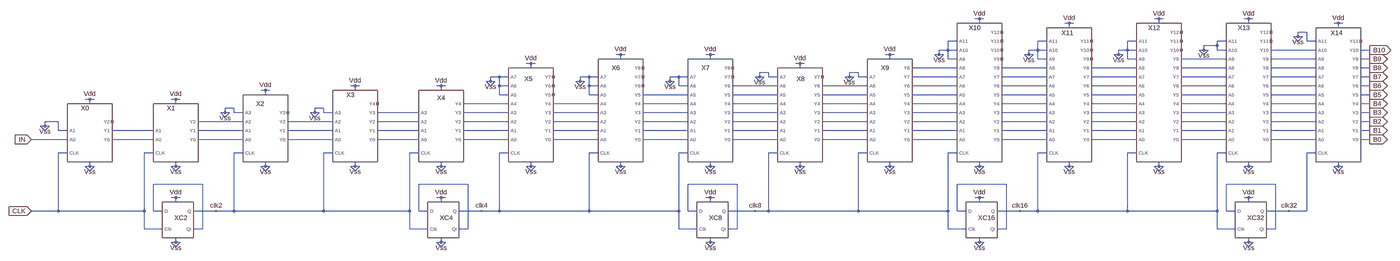
[diagram p0: schematic 5bit_sinc_filter_2nd_order.asc, whole sheet]
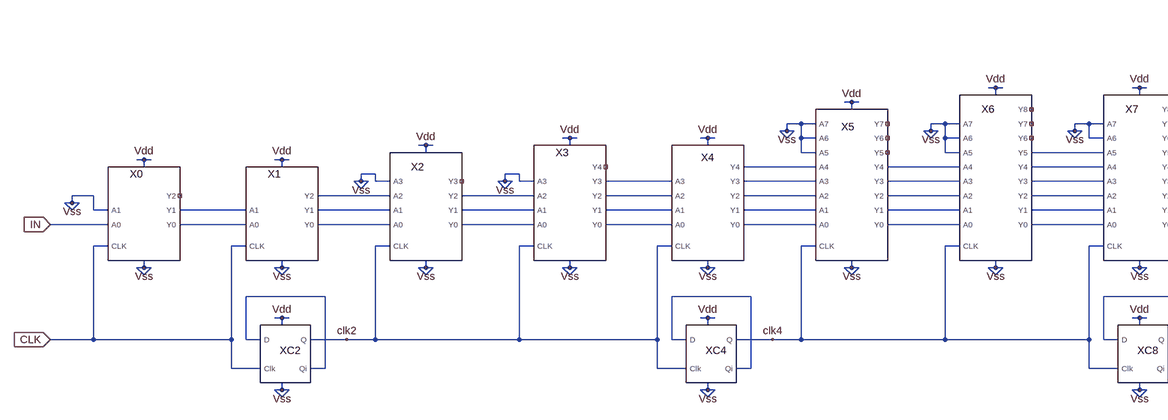
[diagram p1: schematic 5bit_sinc_filter_2nd_order.asc, part, row 1 of 1, column 1 of 2]
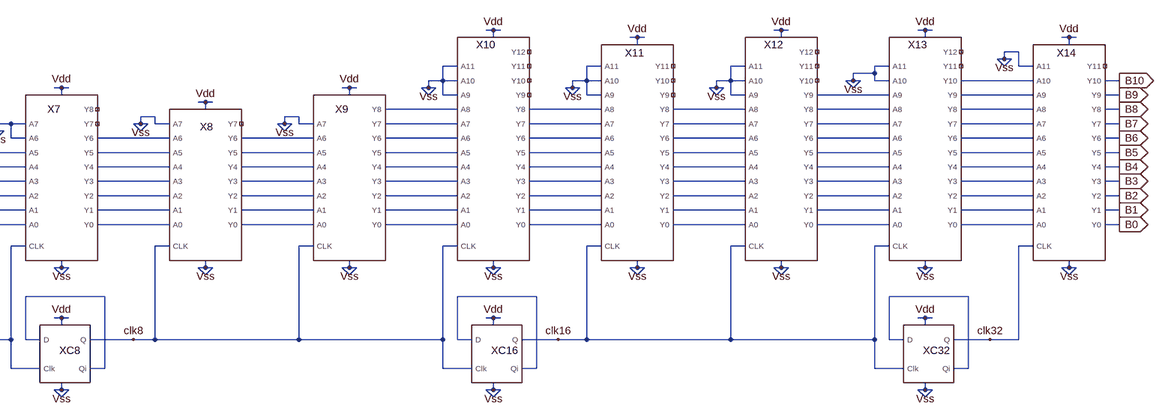
[diagram p2: schematic 5bit_sinc_filter_2nd_order.asc, part, row 1 of 1, column 2 of 2]
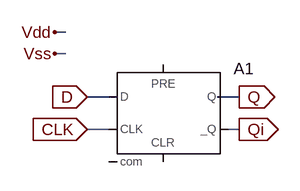
[diagram p3: sub-circuit dff.asc]
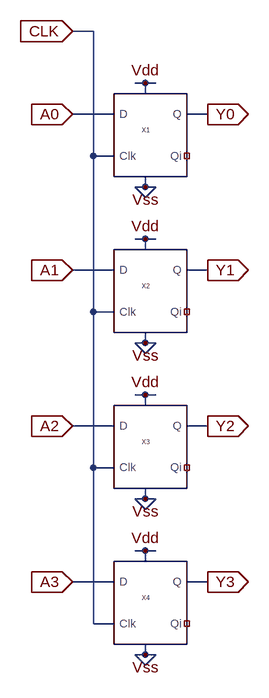
[diagram p4: sub-circuit 4bitreg.asc]
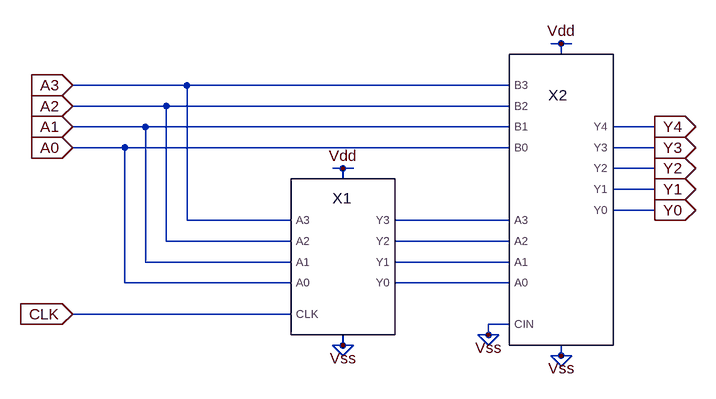
[diagram p5: sub-circuit 4bitavg.asc]
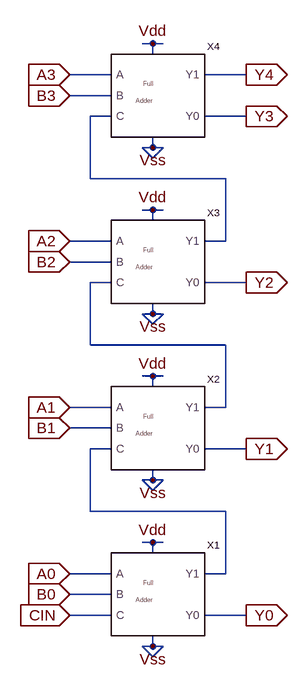
[diagram p6: sub-circuit 4bitadder.asc]
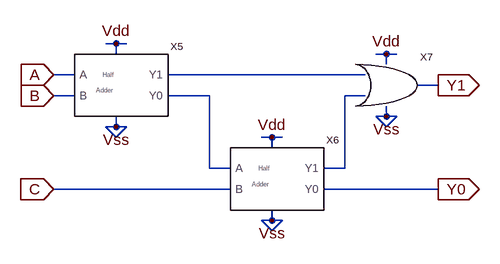
[diagram p7: sub-circuit fulladder.asc]
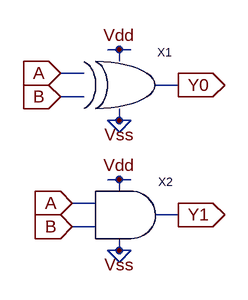
[diagram p8: sub-circuit halfadder.asc]
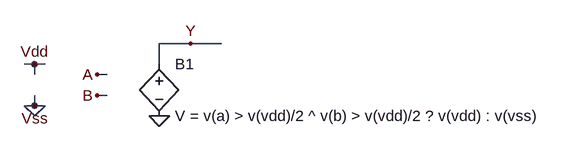
[diagram p9: sub-circuit xor.asc]
5bit_sinc_filter_2nd_order.asc, the LTspice schematic file:
Version 4
SHEET 1 4532 1092
WIRE 2864 -80 2848 -80
WIRE 2880 -80 2864 -80
WIRE 3504 -80 3488 -80
WIRE 3520 -80 3504 -80
WIRE 3824 -80 3808 -80
WIRE 3840 -80 3824 -80
WIRE 2864 -64 2864 -80
WIRE 3184 -64 3168 -64
WIRE 3200 -64 3184 -64
WIRE 3504 -64 3504 -80
WIRE 3824 -64 3824 -80
WIRE 4144 -64 4128 -64
WIRE 4160 -64 4144 -64
WIRE 3184 -48 3184 -64
WIRE 4144 -48 4144 -64
WIRE 4032 -32 4000 -32
WIRE 4000 -16 4000 -32
WIRE 4000 -16 3984 -16
WIRE 4016 -16 4000 -16
WIRE 2784 0 2752 0
WIRE 3104 0 3072 0
WIRE 3424 0 3392 0
WIRE 3744 0 3712 0
WIRE 4000 0 3984 -16
WIRE 4000 0 4016 -16
WIRE 4032 0 4032 -32
WIRE 4064 0 4032 0
WIRE 3712 16 3712 0
WIRE 3712 16 3664 16
WIRE 2752 32 2752 0
WIRE 2752 32 2720 32
WIRE 2784 32 2752 32
WIRE 3072 32 3072 0
WIRE 3072 32 3040 32
WIRE 3104 32 3072 32
WIRE 3392 32 3392 0
WIRE 3392 32 3360 32
WIRE 3424 32 3392 32
WIRE 3664 32 3664 16
WIRE 3664 32 3648 32
WIRE 3680 32 3664 32
WIRE 3712 32 3712 16
WIRE 3744 32 3712 32
WIRE 4064 32 3904 32
WIRE 4256 32 4224 32
WIRE 1584 48 1568 48
WIRE 1600 48 1584 48
WIRE 1904 48 1888 48
WIRE 1920 48 1904 48
WIRE 2544 48 2528 48
WIRE 2560 48 2544 48
WIRE 2720 48 2720 32
WIRE 2720 48 2704 48
WIRE 2736 48 2720 48
WIRE 3040 48 3040 32
WIRE 3040 48 3024 48
WIRE 3056 48 3040 48
WIRE 3360 48 3360 32
WIRE 3360 48 3344 48
WIRE 3376 48 3360 48
WIRE 3664 48 3648 32
WIRE 3664 48 3680 32
WIRE 1584 64 1584 48
WIRE 1904 64 1904 48
WIRE 2544 64 2544 48
WIRE 2720 64 2704 48
WIRE 2720 64 2736 48
WIRE 2752 64 2752 32
WIRE 2784 64 2752 64
WIRE 3040 64 3024 48
WIRE 3040 64 3056 48
WIRE 3072 64 3072 32
WIRE 3104 64 3072 64
WIRE 3360 64 3344 48
WIRE 3360 64 3376 48
WIRE 3392 64 3392 32
WIRE 3424 64 3392 64
WIRE 3744 64 3584 64
WIRE 4064 64 3904 64
WIRE 4256 64 4224 64
WIRE 1264 80 1248 80
WIRE 1280 80 1264 80
WIRE 2224 80 2208 80
WIRE 2240 80 2224 80
WIRE 1264 96 1264 80
WIRE 2224 96 2224 80
WIRE 2784 96 2624 96
WIRE 3104 96 2944 96
WIRE 3424 96 3264 96
WIRE 3744 96 3584 96
WIRE 4064 96 3904 96
WIRE 4256 96 4224 96
WIRE 2112 112 2080 112
WIRE 2432 112 2400 112
WIRE 1152 128 1120 128
WIRE 1184 128 1152 128
WIRE 1472 128 1440 128
WIRE 1504 128 1472 128
WIRE 1792 128 1760 128
WIRE 1824 128 1792 128
WIRE 2080 128 2080 112
WIRE 2080 128 2064 128
WIRE 2096 128 2080 128
WIRE 2112 128 2112 112
WIRE 2144 128 2112 128
WIRE 2400 128 2400 112
WIRE 2400 128 2384 128
WIRE 2416 128 2400 128
WIRE 2432 128 2432 112
WIRE 2464 128 2432 128
WIRE 2784 128 2624 128
WIRE 3104 128 2944 128
WIRE 3424 128 3264 128
WIRE 3744 128 3584 128
WIRE 4064 128 3904 128
WIRE 4256 128 4224 128
WIRE 1120 144 1120 128
WIRE 1120 144 1104 144
WIRE 1136 144 1120 144
WIRE 1440 144 1440 128
WIRE 1440 144 1424 144
WIRE 1456 144 1440 144
WIRE 1760 144 1760 128
WIRE 1760 144 1744 144
WIRE 1776 144 1760 144
WIRE 2080 144 2064 128
WIRE 2080 144 2096 128
WIRE 2400 144 2384 128
WIRE 2400 144 2416 128
WIRE 624 160 608 160
WIRE 640 160 624 160
WIRE 944 160 928 160
WIRE 960 160 944 160
WIRE 1120 160 1104 144
WIRE 1120 160 1136 144
WIRE 1152 160 1152 128
WIRE 1184 160 1152 160
WIRE 1440 160 1424 144
WIRE 1440 160 1456 144
WIRE 1472 160 1472 128
WIRE 1504 160 1472 160
WIRE 1760 160 1744 144
WIRE 1760 160 1776 144
WIRE 1792 160 1792 128
WIRE 1824 160 1792 160
WIRE 2144 160 1984 160
WIRE 2464 160 2304 160
WIRE 2784 160 2624 160
WIRE 3104 160 2944 160
WIRE 3424 160 3264 160
WIRE 3744 160 3584 160
WIRE 4064 160 3904 160
WIRE 4256 160 4224 160
WIRE 304 176 288 176
WIRE 320 176 304 176
WIRE 624 176 624 160
WIRE 944 176 944 160
WIRE 304 192 304 176
WIRE 1152 192 1152 160
WIRE 1184 192 1152 192
WIRE 1472 192 1472 160
WIRE 1504 192 1472 192
WIRE 1824 192 1664 192
WIRE 2144 192 1984 192
WIRE 2464 192 2304 192
WIRE 2784 192 2624 192
WIRE 3104 192 2944 192
WIRE 3424 192 3264 192
WIRE 3744 192 3584 192
WIRE 4064 192 3904 192
WIRE 4256 192 4224 192
WIRE -336 208 -352 208
WIRE -320 208 -336 208
WIRE -16 208 -32 208
WIRE 0 208 -16 208
WIRE -336 224 -336 208
WIRE -16 224 -16 208
WIRE 1184 224 1024 224
WIRE 1504 224 1344 224
WIRE 1824 224 1664 224
WIRE 2144 224 1984 224
WIRE 2464 224 2304 224
WIRE 2784 224 2624 224
WIRE 3104 224 2944 224
WIRE 3424 224 3264 224
WIRE 3744 224 3584 224
WIRE 4064 224 3904 224
WIRE 4256 224 4224 224
WIRE 192 240 160 240
WIRE 512 240 480 240
WIRE 160 256 160 240
WIRE 160 256 144 256
WIRE 176 256 160 256
WIRE 192 256 192 240
WIRE 224 256 192 256
WIRE 480 256 480 240
WIRE 480 256 464 256
WIRE 496 256 480 256
WIRE 512 256 512 240
WIRE 544 256 512 256
WIRE 864 256 704 256
WIRE 1184 256 1024 256
WIRE 1504 256 1344 256
WIRE 1824 256 1664 256
WIRE 2144 256 1984 256
WIRE 2464 256 2304 256
WIRE 2784 256 2624 256
WIRE 3104 256 2944 256
WIRE 3424 256 3264 256
WIRE 3744 256 3584 256
WIRE 4064 256 3904 256
WIRE 4256 256 4224 256
WIRE 160 272 144 256
WIRE 160 272 176 256
WIRE 480 272 464 256
WIRE 480 272 496 256
WIRE -448 288 -496 288
WIRE 224 288 64 288
WIRE 544 288 384 288
WIRE 864 288 704 288
WIRE 1184 288 1024 288
WIRE 1504 288 1344 288
WIRE 1824 288 1664 288
WIRE 2144 288 1984 288
WIRE 2464 288 2304 288
WIRE 2784 288 2624 288
WIRE 3104 288 2944 288
WIRE 3424 288 3264 288
WIRE 3744 288 3584 288
WIRE 4064 288 3904 288
WIRE 4256 288 4224 288
WIRE -496 304 -496 288
WIRE -496 304 -512 304
WIRE -480 304 -496 304
WIRE -496 320 -512 304
WIRE -496 320 -480 304
WIRE -448 320 -448 288
WIRE -416 320 -448 320
WIRE -96 320 -256 320
WIRE 224 320 64 320
WIRE 544 320 384 320
WIRE 864 320 704 320
WIRE 1184 320 1024 320
WIRE 1504 320 1344 320
WIRE 1824 320 1664 320
WIRE 2144 320 1984 320
WIRE 2464 320 2304 320
WIRE 2784 320 2624 320
WIRE 3104 320 2944 320
WIRE 3424 320 3264 320
WIRE 3744 320 3584 320
WIRE 4064 320 3904 320
WIRE 4256 320 4224 320
WIRE -416 352 -544 352
WIRE -96 352 -256 352
WIRE 224 352 64 352
WIRE 544 352 384 352
WIRE 864 352 704 352
WIRE 1184 352 1024 352
WIRE 1504 352 1344 352
WIRE 1824 352 1664 352
WIRE 2144 352 1984 352
WIRE 2464 352 2304 352
WIRE 2784 352 2624 352
WIRE 3104 352 2944 352
WIRE 3424 352 3264 352
WIRE 3744 352 3584 352
WIRE 4064 352 3904 352
WIRE 4256 352 4224 352
WIRE -416 400 -448 400
WIRE -96 400 -128 400
WIRE 224 400 192 400
WIRE 544 400 512 400
WIRE 864 400 832 400
WIRE 1184 400 1152 400
WIRE 1504 400 1472 400
WIRE 1824 400 1792 400
WIRE 2144 400 2112 400
WIRE 2464 400 2432 400
WIRE 2784 400 2752 400
WIRE 3104 400 3072 400
WIRE 3424 400 3392 400
WIRE 3744 400 3712 400
WIRE 4064 400 4032 400
WIRE -336 448 -336 432
WIRE -336 448 -352 448
WIRE -320 448 -336 448
WIRE -16 448 -16 432
WIRE -16 448 -32 448
WIRE 0 448 -16 448
WIRE 304 448 304 432
WIRE 304 448 288 448
WIRE 320 448 304 448
WIRE 624 448 624 432
WIRE 624 448 608 448
WIRE 640 448 624 448
WIRE 944 448 944 432
WIRE 944 448 928 448
WIRE 960 448 944 448
WIRE 1264 448 1264 432
WIRE 1264 448 1248 448
WIRE 1280 448 1264 448
WIRE 1584 448 1584 432
WIRE 1584 448 1568 448
WIRE 1600 448 1584 448
WIRE 1904 448 1904 432
WIRE 1904 448 1888 448
WIRE 1920 448 1904 448
WIRE 2224 448 2224 432
WIRE 2224 448 2208 448
WIRE 2240 448 2224 448
WIRE 2544 448 2544 432
WIRE 2544 448 2528 448
WIRE 2560 448 2544 448
WIRE 2864 448 2864 432
WIRE 2864 448 2848 448
WIRE 2880 448 2864 448
WIRE 3184 448 3184 432
WIRE 3184 448 3168 448
WIRE 3200 448 3184 448
WIRE 3504 448 3504 432
WIRE 3504 448 3488 448
WIRE 3520 448 3504 448
WIRE 3824 448 3824 432
WIRE 3824 448 3808 448
WIRE 3840 448 3824 448
WIRE 4144 448 4144 432
WIRE 4144 448 4128 448
WIRE 4160 448 4144 448
WIRE -336 464 -352 448
WIRE -336 464 -320 448
WIRE -16 464 -32 448
WIRE -16 464 0 448
WIRE 304 464 288 448
WIRE 304 464 320 448
WIRE 624 464 608 448
WIRE 624 464 640 448
WIRE 944 464 928 448
WIRE 944 464 960 448
WIRE 1264 464 1248 448
WIRE 1264 464 1280 448
WIRE 1584 464 1568 448
WIRE 1584 464 1600 448
WIRE 1904 464 1888 448
WIRE 1904 464 1920 448
WIRE 2224 464 2208 448
WIRE 2224 464 2240 448
WIRE 2544 464 2528 448
WIRE 2544 464 2560 448
WIRE 2864 464 2848 448
WIRE 2864 464 2880 448
WIRE 3184 464 3168 448
WIRE 3184 464 3200 448
WIRE 3504 464 3488 448
WIRE 3504 464 3520 448
WIRE 3824 464 3808 448
WIRE 3824 464 3840 448
WIRE 4144 464 4128 448
WIRE 4144 464 4160 448
WIRE 80 512 -96 512
WIRE 1040 512 864 512
WIRE 2000 512 1824 512
WIRE 2960 512 2784 512
WIRE 3920 512 3744 512
WIRE -16 560 -32 560
WIRE 0 560 -16 560
WIRE 944 560 928 560
WIRE 960 560 944 560
WIRE 1904 560 1888 560
WIRE 1920 560 1904 560
WIRE 2864 560 2848 560
WIRE 2880 560 2864 560
WIRE 3824 560 3808 560
WIRE 3840 560 3824 560
WIRE -16 576 -16 560
WIRE 944 576 944 560
WIRE 1904 576 1904 560
WIRE 2864 576 2864 560
WIRE 3824 576 3824 560
WIRE -448 608 -448 400
WIRE -448 608 -544 608
WIRE -128 608 -128 400
WIRE -128 608 -448 608
WIRE -96 608 -96 512
WIRE -64 608 -96 608
WIRE 128 608 48 608
WIRE 192 608 192 400
WIRE 192 608 128 608
WIRE 512 608 512 400
WIRE 512 608 192 608
WIRE 832 608 832 400
WIRE 832 608 512 608
WIRE 864 608 864 512
WIRE 896 608 864 608
WIRE 1088 608 1008 608
WIRE 1152 608 1152 400
WIRE 1152 608 1088 608
WIRE 1472 608 1472 400
WIRE 1472 608 1152 608
WIRE 1792 608 1792 400
WIRE 1792 608 1472 608
WIRE 1824 608 1824 512
WIRE 1856 608 1824 608
WIRE 2064 608 1968 608
WIRE 2112 608 2112 400
WIRE 2112 608 2064 608
WIRE 2432 608 2432 400
WIRE 2432 608 2112 608
WIRE 2752 608 2752 400
WIRE 2752 608 2432 608
WIRE 2784 608 2784 512
WIRE 2816 608 2784 608
WIRE 3008 608 2928 608
WIRE 3072 608 3072 400
WIRE 3072 608 3008 608
WIRE 3392 608 3392 400
WIRE 3392 608 3072 608
WIRE 3712 608 3712 400
WIRE 3712 608 3392 608
WIRE 3744 608 3744 512
WIRE 3776 608 3744 608
WIRE 3968 608 3888 608
WIRE 4032 608 4032 400
WIRE 4032 608 3968 608
WIRE -128 672 -128 608
WIRE -64 672 -128 672
WIRE 80 672 80 512
WIRE 80 672 48 672
WIRE 832 672 832 608
WIRE 896 672 832 672
WIRE 1040 672 1040 512
WIRE 1040 672 1008 672
WIRE 1792 672 1792 608
WIRE 1856 672 1792 672
WIRE 2000 672 2000 512
WIRE 2000 672 1968 672
WIRE 2752 672 2752 608
WIRE 2816 672 2752 672
WIRE 2960 672 2960 512
WIRE 2960 672 2928 672
WIRE 3712 672 3712 608
WIRE 3776 672 3712 672
WIRE 3920 672 3920 512
WIRE 3920 672 3888 672
WIRE -16 720 -16 704
WIRE -16 720 -32 720
WIRE 0 720 -16 720
WIRE 944 720 944 704
WIRE 944 720 928 720
WIRE 960 720 944 720
WIRE 1904 720 1904 704
WIRE 1904 720 1888 720
WIRE 1920 720 1904 720
WIRE 2864 720 2864 704
WIRE 2864 720 2848 720
WIRE 2880 720 2864 720
WIRE 3824 720 3824 704
WIRE 3824 720 3808 720
WIRE 3840 720 3824 720
WIRE -16 736 -32 720
WIRE -16 736 0 720
WIRE 944 736 928 720
WIRE 944 736 960 720
WIRE 1904 736 1888 720
WIRE 1904 736 1920 720
WIRE 2864 736 2848 720
WIRE 2864 736 2880 720
WIRE 3824 736 3808 720
WIRE 3824 736 3840 720
FLAG 304 448 Vss
FLAG 4256 352 B0
IOPIN 4256 352 Out
FLAG 4256 320 B1
IOPIN 4256 320 Out
FLAG 4256 288 B2
IOPIN 4256 288 Out
FLAG 4256 256 B3
IOPIN 4256 256 Out
FLAG 4256 224 B4
IOPIN 4256 224 Out
FLAG 4256 192 B5
IOPIN 4256 192 Out
FLAG 4256 160 B6
IOPIN 4256 160 Out
FLAG 4256 128 B7
IOPIN 4256 128 Out
FLAG -16 560 Vdd
FLAG -16 720 Vss
FLAG -336 448 Vss
FLAG -336 208 Vdd
FLAG -16 448 Vss
FLAG -16 208 Vdd
FLAG -544 608 CLK
IOPIN -544 608 In
FLAG -544 352 IN
IOPIN -544 352 In
FLAG -496 304 Vss
FLAG 160 256 Vss
FLAG 1264 80 Vdd
FLAG 1264 448 Vss
FLAG 944 560 Vdd
FLAG 944 720 Vss
FLAG 624 448 Vss
FLAG 944 448 Vss
FLAG 480 256 Vss
FLAG 1120 144 Vss
FLAG 2224 80 Vdd
FLAG 2224 448 Vss
FLAG 1904 560 Vdd
FLAG 1904 720 Vss
FLAG 1584 448 Vss
FLAG 1584 48 Vdd
FLAG 1904 448 Vss
FLAG 1904 48 Vdd
FLAG 1440 144 Vss
FLAG 1760 144 Vss
FLAG 2080 128 Vss
FLAG 3184 -64 Vdd
FLAG 3184 448 Vss
FLAG 2864 560 Vdd
FLAG 2864 720 Vss
FLAG 2544 448 Vss
FLAG 2544 48 Vdd
FLAG 2864 448 Vss
FLAG 2864 -80 Vdd
FLAG 2400 128 Vss
FLAG 128 608 clk2
FLAG 1088 608 clk4
FLAG 2064 608 clk8
FLAG 3008 608 clk16
FLAG 304 176 Vdd
FLAG 624 160 Vdd
FLAG 944 160 Vdd
FLAG 2720 48 Vss
FLAG 3040 48 Vss
FLAG 4144 -64 Vdd
FLAG 4144 448 Vss
FLAG 3824 560 Vdd
FLAG 3824 720 Vss
FLAG 3504 448 Vss
FLAG 3824 448 Vss
FLAG 3824 -80 Vdd
FLAG 3968 608 clk32
FLAG 3664 32 Vss
FLAG 4000 -16 Vss
FLAG 3504 -80 Vdd
FLAG 3360 48 Vss
FLAG 4256 96 B8
IOPIN 4256 96 Out
FLAG 4256 64 B9
IOPIN 4256 64 Out
FLAG 4256 32 B10
IOPIN 4256 32 Out
SYMBOL dff -64 704 R0
SYMATTR InstName XC2
SYMBOL dff 896 704 R0
SYMATTR InstName XC4
SYMBOL dff 1856 704 R0
SYMATTR InstName XC8
SYMBOL dff 2816 704 R0
SYMATTR InstName XC16
SYMBOL 4bitreg 224 432 R0
SYMATTR InstName X2
SYMBOL 4bitavg 544 432 R0
SYMATTR InstName X3
SYMBOL 4bitavg 864 432 R0
WINDOW 0 65 -229 Left 0
SYMATTR InstName X4
SYMBOL 8bitreg 1184 432 R0
WINDOW 1 76 -102 VLeft 0
WINDOW 0 57 -297 Left 0
SYMATTR InstName X5
SYMBOL 8bitreg 2144 432 R0
WINDOW 1 88 -121 VLeft 0
WINDOW 0 68 -297 Left 0
SYMATTR InstName X8
SYMBOL 8bitavg 1504 432 R0
WINDOW 1 77 -129 VLeft 0
SYMATTR InstName X6
SYMBOL 8bitavg 1824 432 R0
WINDOW 1 88 -103 VLeft 0
SYMATTR InstName X7
SYMBOL 8bitavg 2464 432 R0
WINDOW 1 82 -126 VLeft 0
SYMATTR InstName X9
SYMBOL 2bitavg -416 432 R0
SYMATTR InstName X0
SYMBOL 2bitavg -96 432 R0
SYMATTR InstName X1
SYMBOL 12bitavg 2784 432 R0
WINDOW 1 71 -156 VLeft 0
SYMATTR InstName X10
SYMBOL 12bitreg 3104 432 R0
WINDOW 1 74 -170 VLeft 0
SYMATTR InstName X11
SYMBOL dff 3776 704 R0
SYMATTR InstName XC32
SYMBOL 12bitavg 3744 432 R0
WINDOW 1 80 -199 VLeft 0
SYMATTR InstName X13
SYMBOL 12bitreg 4064 432 R0
WINDOW 1 81 -180 VLeft 0
SYMATTR InstName X14
SYMBOL 12bitavg 3424 432 R0
WINDOW 1 85 -218 VLeft 0
SYMATTR InstName X12

The netlist it stands for:
* 5bit_sinc_filter_2nd_order.asc
XXC2 N091 CLK clk2 N091 Vdd Vss dff
XXC4 N092 clk2 clk4 N092 Vdd Vss dff
XXC8 N093 clk4 clk8 N093 Vdd Vss dff
XXC16 N094 clk8 clk16 N094 Vdd Vss dff
XX2 Vdd Vss clk2 N078 N064 N050 Vss N079 N065 N051 NC_01 4bitreg
XX3 Vdd Vss clk2 N079 N065 N051 Vss N080 N066 N052 N039 NC_02 4bitavg
XX4 Vdd Vss clk2 N080 N066 N052 N039 N081 N067 N053 N040 N029 4bitavg
XX5 Vdd Vss clk4 N081 N067 N053 N040 N029 Vss Vss Vss N082 N068 N054 N041 N030 NC_03 NC_04 NC_05 8bitreg
XX8 Vdd Vss clk8 N084 N070 N056 N043 N032 N022 N014 Vss N085 N071 N057 N044 N033 N023 N015 NC_06 8bitreg
XX6 Vdd Vss clk4 N082 N068 N054 N041 N030 Vss Vss Vss N083 N069 N055 N042 N031 N021 NC_07 NC_08 NC_09 8bitavg
XX7 Vdd Vss clk4 N083 N069 N055 N042 N031 N021 Vss Vss N084 N070 N056 N043 N032 N022 N014 NC_10 NC_11 8bitavg
XX9 Vdd Vss clk8 N085 N071 N057 N044 N033 N023 N015 Vss N086 N072 N058 N045 N034 N024 N016 N009 N004 8bitavg
XX0 Vdd Vss CLK IN Vss N077 N063 NC_12 2bitavg
XX1 Vdd Vss CLK N077 N063 N078 N064 N050 2bitavg
XX10 Vdd Vss clk8 N086 N072 N058 N045 N034 N024 N016 N009 N004 Vss Vss Vss N087 N073 N059 N046 N035 N025 N017 N010 N005 NC_13 NC_14 NC_15 NC_16 12bitavg
XX11 Vdd Vss clk16 N087 N073 N059 N046 N035 N025 N017 N010 N005 Vss Vss Vss N088 N074 N060 N047 N036 N026 N018 N011 N006 NC_17 NC_18 NC_19 12bitreg
XXC32 N095 clk16 clk32 N095 Vdd Vss dff
XX13 Vdd Vss clk16 N089 N075 N061 N048 N037 N027 N019 N012 N007 N002 Vss Vss N090 N076 N062 N049 N038 N028 N020 N013 N008 N003 N001 NC_20 NC_21 12bitavg
XX14 Vdd Vss clk32 N090 N076 N062 N049 N038 N028 N020 N013 N008 N003 N001 Vss B0 B1 B2 B3 B4 B5 B6 B7 B8 B9 B10 NC_22 12bitreg
XX12 Vdd Vss clk16 N088 N074 N060 N047 N036 N026 N018 N011 N006 Vss Vss Vss N089 N075 N061 N048 N037 N027 N019 N012 N007 N002 NC_23 NC_24 NC_25 12bitavg

* block symbol definitions
.subckt dff D Clk Q Qi VDD Vss
A1 D 0 CLK 0 0 Qi Q 0 DFLOP vhigh=5 tau=1n
.ends dff

.subckt 4bitreg Vdd Vss CLK A0 A1 A2 A3 Y0 Y1 Y2 Y3
XX1 A0 CLK Y0 NC_01 Vdd Vss dff
XX2 A1 CLK Y1 NC_02 Vdd Vss dff
XX3 A2 CLK Y2 NC_03 Vdd Vss dff
XX4 A3 CLK Y3 NC_04 Vdd Vss dff
.ends 4bitreg

.subckt 4bitavg Vdd Vss CLK A0 A1 A2 A3 Y0 Y1 Y2 Y3 Y4
XX1 Vdd Vss CLK A0 A1 A2 A3 N004 N003 N002 N001 4bitreg
XX2 Vdd Vss Vss N004 N003 N002 N001 A0 A1 A2 A3 Y0 Y1 Y2 Y3 Y4 4bitadder
.ends 4bitavg

.subckt 4bitadder Vdd Vss CIN A0 A1 A2 A3 B0 B1 B2 B3 Y0 Y1 Y2 Y3 Y4
XX1 A0 B0 Y0 N003 Vdd Vss CIN fulladder
XX2 A1 B1 Y1 N002 Vdd Vss N003 fulladder
XX3 A2 B2 Y2 N001 Vdd Vss N002 fulladder
XX4 A3 B3 Y3 Y4 Vdd Vss N001 fulladder
.ends 4bitadder

.subckt fulladder A B Y0 Y1 Vdd Vss C
XX5 A B N002 N001 Vdd Vss halfadder
XX6 N002 C Y0 N003 Vdd Vss halfadder
XX7 N001 N003 Y1 Vdd Vss or
.ends fulladder

.subckt halfadder A B Y0 Y1 Vdd Vss
XX1 A B Y0 Vdd Vss xor
XX2 A B Y1 Vdd Vss and
.ends halfadder

.subckt xor A B Y Vdd Vss
B1 Y 0 V = v(a) > v(vdd)/2 ^ v(b) > v(vdd)/2 ? v(vdd) : v(vss)
.ends xor

.subckt and A B Y Vdd Vss
B1 Y 0 V=((v(a)>v(vdd)/2)&(v(b)>v(vdd)/2)) ? v(vdd) : v(vss)
.ends and

.subckt or A B Y Vdd Vss
B1 Y 0 V=v(a)>v(vdd)/2 | v(b)>v(vdd)/2 ? v(vdd) : v(vss)
.ends or

.subckt 8bitreg Vdd Vss CLK A0 A1 A2 A3 A4 A5 A6 A7 Y0 Y1 Y2 Y3 Y4 Y5 Y6 Y7
XX1 A0 CLK Y0 NC_01 Vdd Vss dff
XX2 A1 CLK Y1 NC_02 Vdd Vss dff
XX3 A2 CLK Y2 NC_03 Vdd Vss dff
XX4 A3 CLK Y3 NC_04 Vdd Vss dff
XX5 A4 CLK Y4 NC_05 Vdd Vss dff
XX6 A5 CLK Y5 NC_06 Vdd Vss dff
XX7 A6 CLK Y6 NC_07 Vdd Vss dff
XX8 A7 CLK Y7 NC_08 Vdd Vss dff
.ends 8bitreg

.subckt 8bitavg Vdd Vss CLK A0 A1 A2 A3 A4 A5 A6 A7 Y0 Y1 Y2 Y3 Y4 Y5 Y6 Y7 Y8
XX3 Vdd Vss CLK A0 A1 A2 A3 A4 A5 A6 A7 N008 N007 N006 N005 N004 N003 N002 N001 8bitreg
XX4 Vdd Vss Vss N008 N007 N006 N005 N004 N003 N002 N001 A0 A1 A2 A3 A4 A5 A6 A7 Y0 Y1 Y2 Y3 Y4 Y5 Y6 Y7 Y8 8bitadder
.ends 8bitavg

.subckt 8bitadder Vdd Vss CIN A0 A1 A2 A3 A4 A5 A6 A7 B0 B1 B2 B3 B4 B5 B6 B7 Y0 Y1 Y2 Y3 Y4 Y5 Y6 Y7 Y8
XX1 A0 B0 Y0 N006 Vdd Vss CIN fulladder
XX2 A1 B1 Y1 N004 Vdd Vss N006 fulladder
XX3 A2 B2 Y2 N002 Vdd Vss N004 fulladder
XX4 A3 B3 Y3 N001 Vdd Vss N002 fulladder
XX5 A4 B4 Y4 N007 Vdd Vss N001 fulladder
XX6 A5 B5 Y5 N005 Vdd Vss N007 fulladder
XX7 A6 B6 Y6 N003 Vdd Vss N005 fulladder
XX8 A7 B7 Y7 Y8 Vdd Vss N003 fulladder
.ends 8bitadder

.subckt 2bitavg Vdd Vss CLK A0 A1 Y0 Y1 Y2
XX1 Vdd Vss CLK A0 A1 N002 N001 2bitreg
XX2 Vdd Vss Vss N002 N001 A0 A1 Y0 Y1 Y2 2bitadder
.ends 2bitavg

.subckt 2bitreg Vdd Vss CLK A0 A1 Y0 Y1
XX1 A0 CLK Y0 NC_01 Vdd Vss dff
XX2 A1 CLK Y1 NC_02 Vdd Vss dff
.ends 2bitreg

.subckt 2bitadder Vdd Vss CIN A0 A1 B0 B1 Y0 Y1 Y2
XX1 A0 B0 Y0 N001 Vdd Vss CIN fulladder
XX2 A1 B1 Y1 Y2 Vdd Vss N001 fulladder
.ends 2bitadder

.subckt 12bitavg Vdd Vss CLK A0 A1 A2 A3 A4 A5 A6 A7 A8 A9 A10 A11 Y0 Y1 Y2 Y3 Y4 Y5 Y6 Y7 Y8 Y9 Y10 Y11 Y12
XX1 Vdd Vss Vss N012 N011 N010 N009 N008 N007 N006 N005 N004 N003 N002 N001 A0 A1 A2 A3 A4 A5 A6 A7 A8 A9 A10 A11 Y0 Y1 Y2 Y3 Y4 Y5 Y6 Y7 Y8 Y9 Y10 Y11 Y12 12bitadder
XX2 Vdd Vss CLK A0 A1 A2 A3 A4 A5 A6 A7 A8 A9 A10 A11 N012 N011 N010 N009 N008 N007 N006 N005 N004 N003 N002 N001 12bitreg
.ends 12bitavg

.subckt 12bitadder Vdd Vss CIN A0 A1 A2 A3 A4 A5 A6 A7 A8 A9 A10 A11 B0 B1 B2 B3 B4 B5 B6 B7 B8 B9 B10 B11 Y0 Y1 Y2 Y3 Y4 Y5 Y6 Y7 Y8 Y9 Y10 Y11 Y12
XX1 A0 B0 Y0 N009 Vdd Vss CIN fulladder
XX2 A1 B1 Y1 N006 Vdd Vss N009 fulladder
XX3 A2 B2 Y2 N003 Vdd Vss N006 fulladder
XX4 A3 B3 Y3 N001 Vdd Vss N003 fulladder
XX5 A4 B4 Y4 N010 Vdd Vss N001 fulladder
XX6 A5 B5 Y5 N007 Vdd Vss N010 fulladder
XX7 A6 B6 Y6 N004 Vdd Vss N007 fulladder
XX8 A7 B7 Y7 N002 Vdd Vss N004 fulladder
XX9 A8 B8 Y8 N011 Vdd Vss N002 fulladder
XX10 A9 B9 Y9 N008 Vdd Vss N011 fulladder
XX11 A10 B10 Y10 N005 Vdd Vss N008 fulladder
XX12 A11 B11 Y11 Y12 Vdd Vss N005 fulladder
.ends 12bitadder

.subckt 12bitreg Vdd Vss CLK A0 A1 A2 A3 A4 A5 A6 A7 A8 A9 A10 A11 Y0 Y1 Y2 Y3 Y4 Y5 Y6 Y7 Y8 Y9 Y10 Y11
XX1 A0 CLK Y0 NC_01 Vdd Vss dff
XX2 A1 CLK Y1 NC_02 Vdd Vss dff
XX3 A2 CLK Y2 NC_03 Vdd Vss dff
XX4 A3 CLK Y3 NC_04 Vdd Vss dff
XX5 A4 CLK Y4 NC_05 Vdd Vss dff
XX6 A5 CLK Y5 NC_06 Vdd Vss dff
XX7 A6 CLK Y6 NC_07 Vdd Vss dff
XX8 A7 CLK Y7 NC_08 Vdd Vss dff
XX9 A8 CLK Y8 NC_09 Vdd Vss dff
XX10 A9 CLK Y9 NC_10 Vdd Vss dff
XX11 A10 CLK Y10 NC_11 Vdd Vss dff
XX12 A11 CLK Y11 NC_12 Vdd Vss dff
.ends 12bitreg

.backanno
.end